# EAGLE design Sens_LM75 (EAGLE 6.3)
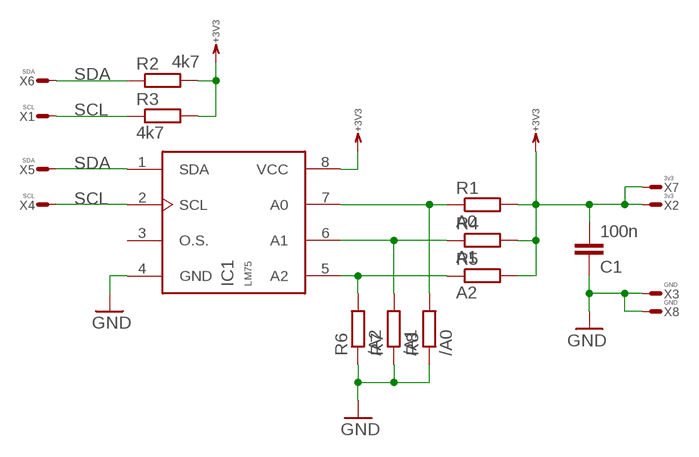
[diagram p0: schematic, sheet 1]

## Parts
C1  100n  C0603  [0603]
IC1  LM75  LM75M  [SO8]
R1  A0  R0603  [0603]
R2  4k7  R0603  [0603]
R3  4k7  R0603  [0603]
R4  A1  R0603  [0603]
R5  A2  R0603  [0603]
R6  /A2  R0603  [0603]
R7  /A1  R0603  [0603]
R8  /A0  R0603  [0603]
X1  SCL  WIREPADT1.6/0.9  [T1.6/0.9]
X2  3v3  WIREPADT1.6/0.9  [T1.6/0.9]
X3  GND  WIREPADT1.6/0.9  [T1.6/0.9]
X4  SCL  WIREPADT1.6/0.9  [T1.6/0.9]
X5  SDA  WIREPADT1.6/0.9  [T1.6/0.9]
X6  SDA  WIREPADT1.6/0.9  [T1.6/0.9]
X7  3v3  WIREPADT1.6/0.9  [T1.6/0.9]
X8  GND  WIREPADT1.6/0.9  [T1.6/0.9]

## Nets
+3V3: C1.2 IC1.8(VCC) R1.2 R2.2 R3.2 R4.2 R5.2 X2.1(S) X7.1(S)
GND: C1.1 IC1.4(GND) R6.1 R7.1 R8.1 X3.1(S) X8.1(S)
N$1: IC1.7(A0) R1.1 R8.2
N$2: IC1.6(A1) R4.1 R7.2
N$3: IC1.5(A2) R5.1 R6.2
SCL: IC1.2(SCL) R3.1 X1.1(S) X4.1(S)
SDA: IC1.1(SDA) R2.1 X5.1(S) X6.1(S)
Unconnected: IC1.3(O.S.)

## Library data of the parts
C1 = RCL:C: Capacitor SMD
IC1 = Sensors:LM75
R1-R8 = RCL:R: Resistor SMD
X1-X8 = Conn:WIREPAD: Wire PAD connect wire on PCB

## Board
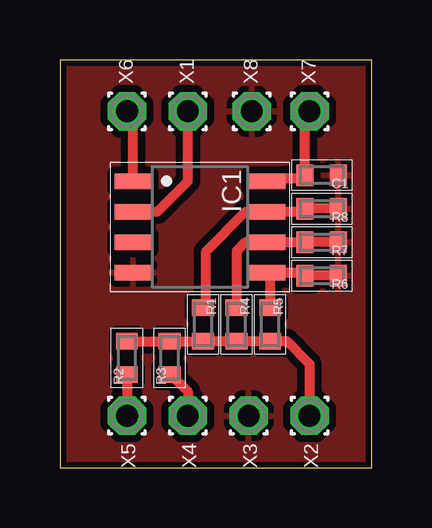
[diagram p1: board, top side]
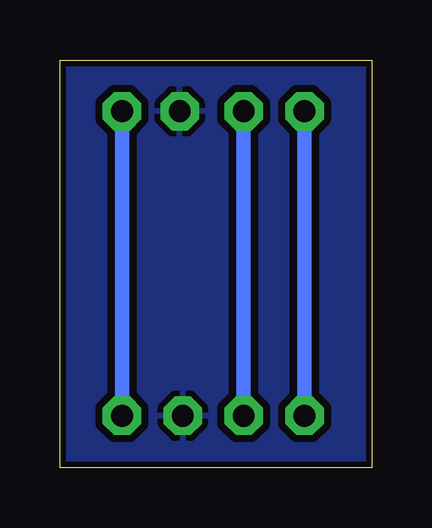
[diagram p2: board, bottom side, seen from below]

Size 13 x 17 mm. Coordinates in mm from the lower left corner, seen from the top.
Outline: 0,0 13,0 13,17 0,17 0,0
Copper layers (1*16): Top 0.035mm / dielectric 1.5mm / Bottom 0.035mm
Design rules "default *": minimum track width 10mil, minimum drill 12mil, track to track 12mil, track to pad 12mil, pad to pad 12mil, via to via 12mil, smd to smd 12mil, copper to edge 10mil, drill to drill 8mil, minimum pad ring 10mil, minimum via ring 8mil, stop-mask expansion 4mil, vias tented up to drill 0mil, thermal gap 10mil

### Footprints (pad centres in the part's own frame; a part is rotated, then mirrored left to right if it is on the bottom)
0603 = smd 0.7 x 0.9: 1 -0.697,0; 2 0.697,0
SO8 = smd 0.635 x 1.524: 1 -1.905,-2.794; 2 -0.635,-2.794; 3 0.635,-2.794; 4 1.905,-2.794; 5 1.905,2.794; 6 0.635,2.794; 7 -0.635,2.794; 8 -1.905,2.794
T1.6/0.9 = drill 0.914 pad 1.6 octagon: 1 0,0

### Placement (x,y rotation side)
C1  10.92,12.19 180 top
IC1  5.84,10.03 270 top
R1  5.97,5.97 270 top
R2  2.79,4.57 90 top
R3  4.57,4.57 90 top
R4  7.37,5.97 270 top
R5  8.76,5.97 270 top
R6  10.92,8 180 top
R7  10.92,9.4 180 top
R8  10.92,10.79 180 top
X1  5.33,14.86 90 top
X2  10.41,2.16 270 top
X3  7.87,2.16 270 top
X4  5.33,2.16 270 top
X5  2.79,2.16 270 top
X6  2.79,14.86 90 top
X7  10.41,14.86 90 top
X8  8,14.86 90 top

### Tracks (layer width: path | path; a pad name or v marks a point on that pad's centre or on a via)
+3V3
  Top 0.406: X7.1 10.22,14.67 C1.2 10.1,12.06 9.4,12.06 9.27,11.94 IC1.8 | R2.2 R3.2 R1.2 R4.2 R5.2 9.46,5.27 10.41,4.32 X2.1
  Bottom 0.61: X7.1 X2.1
GND
  Top 0.406: 11.68,10.79 10.29,10.79 | 11.68,9.4 10.29,9.4 | 11.68,8 10.29,8
  pour Top: 0,17 13,17 13,0 0,0
  pour Bottom: 0,0 13,0 13,17 0,17
N$1
  Top 0.406: R8.2 10.1,10.67 IC1.7 7.75,10.67 6.1,9.02 6.1,6.73 6.03,6.67 R1.1
N$2
  Top 0.406: R4.1 7.37,9.02 7.75,9.4 IC1.6 R7.2
N$3
  Top 0.406: R6.2 10.1,8.13 IC1.5 8.76,8 R5.1
SCL
  Top 0.406: IC1.2 4.06,10.67 5.33,11.94 X1.1 | R3.1 4.63,3.88 5.33,3.17 X4.1
  Bottom 0.61: X4.1 X1.1
SDA
  Top 0.406: R2.1 X5.1 | IC1.1 3.05,14.61 X6.1
  Bottom 0.61: X5.1 X6.1